# Altium schematic sheet Sheet1.SchDoc
size A4; SheetNumber: 1; SheetTotal: 1
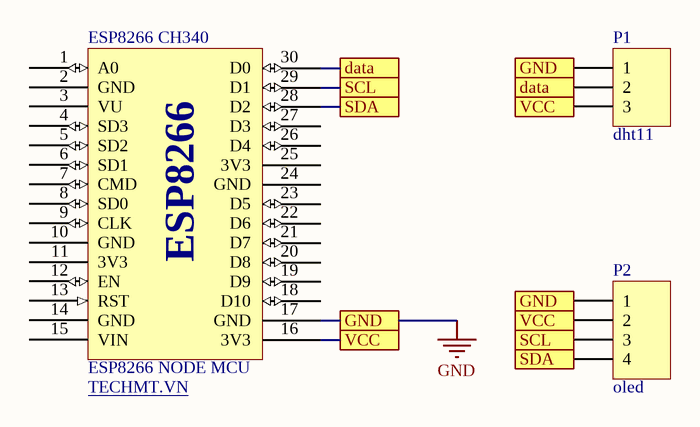
[diagram p0: Sheet1.SchDoc]

## Parts
ESP8266_CH340  ESP8266 NODE MCU  WEB: TECHMT.VN  [ESP8266 NodeMCU]
P1  dht11  [HDR1X3]
P2  oled  [HDR1X4]

## Ports
data, GND, SCL, SDA, VCC

## Nets
GND: ESP8266_CH340.17(GND) P1.1 P2.1 ; port GND
data: ESP8266_CH340.30(D0) P1.2 ; port data
SCL: ESP8266_CH340.29(D1) P2.3 ; port SCL
SDA: ESP8266_CH340.28(D2) P2.4 ; port SDA
VCC: ESP8266_CH340.16(3V3) P1.3 P2.2 ; port VCC

Not connected (* = marked no-connect by the designer): ESP8266_CH340 1(A0) 2(GND) 3(VU) 4(SD3) 5(SD2) 6(SD1) 7(CMD) 8(SD0) 9(CLK) 10(GND) 11(3V3) 12(EN) 13(RST) 14(GND) 15(VIN) 18(D10) 19(D9) 20(D8) 21(D7) 22(D6) 23(D5) 24(GND) 25(3V3) 26(D4) 27(D3)

## Notes on the sheet
- (in symbol ESP8266 NodeMCU) ESP8266

## Library data of the parts
ESP8266_CH340 = ESP8266 NodeMCU: LUA-ESP8266 Wifi Module Techmt.vn
P1 = Header 3: Header, 3-Pin; LatestRevisionDate: 17-Jul-2002; LatestRevisionNote: Re-released for DXP Platform.; Publisher: Altium Limited
P2 = Header 4: Header, 4-Pin; LatestRevisionDate: 17-Jul-2002; LatestRevisionNote: Re-released for DXP Platform.; Publisher: Altium Limited